# EAGLE design DashHub (EAGLE 9.6.2)
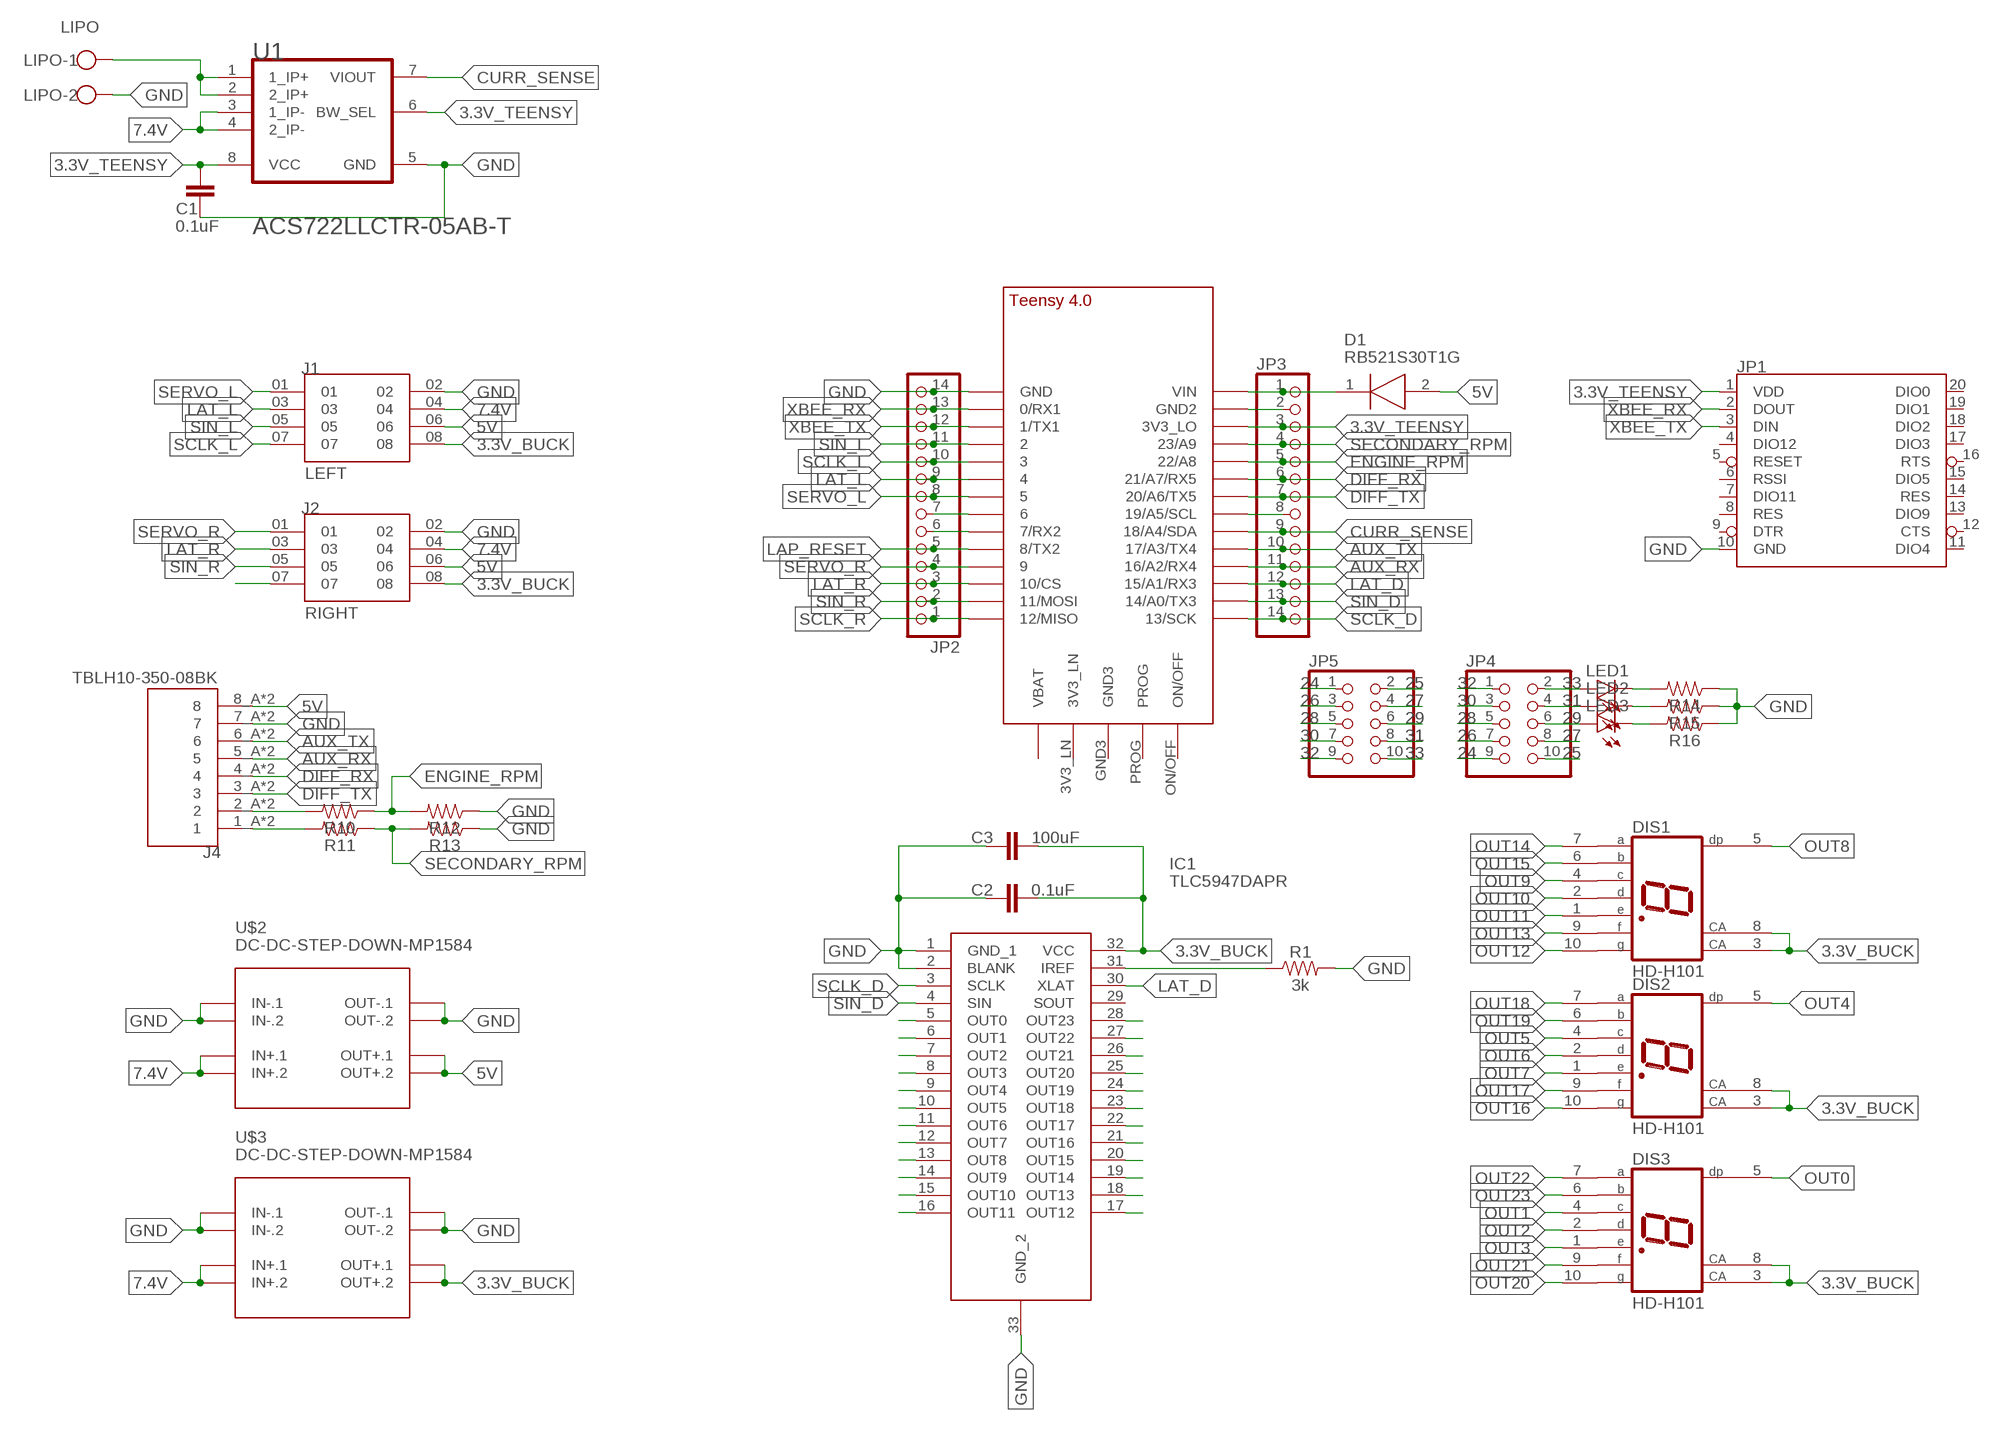
[diagram p0: schematic, sheet 1]

## Parts
C1  0.1uF  C-EUC0402  [C0402]
C2  0.1uF  C-EUC0402  [C0402]
C3  100uF  C-EUC1206  [C1206]
D1  RB521S30T1G  [SODFL1608X70N]
DIS1  HD-H101  [HDSP-M]
DIS2  HD-H101  [HDSP-M]
DIS3  HD-H101  [HDSP-M]
IC1  TLC5947DAPR  [SOP65P810X120-33N]
J1  LEFT  ESW-104-23-L-D  [SAMTEC_ESW-104-23-L-D]
J2  RIGHT  ESW-104-23-L-D  [SAMTEC_ESW-104-23-L-D]
J4  TBLH10-350-08BK  [CUI_TBLH10-350-08BK]
JP1  XBEE  [XBEE]
JP2  PINHD-1X14  [1X14]
JP3  PINHD-1X14  [1X14]
JP4  PINHD-2X5  [2X05]
JP5  PINHD-2X5  [2X05]
LED1  LEDCHIPLED_1206  [CHIPLED_1206]
LED2  LEDCHIPLED_1206  [CHIPLED_1206]
LED3  LEDCHIPLED_1206  [CHIPLED_1206]
LIPO  LIPO  W237-102  [W237-102]
R1  3k  RESISTORAXIAL-0.3  [AXIAL-0.3]
R10  RESISTORAXIAL-0.3  [AXIAL-0.3]
R11  RESISTORAXIAL-0.3  [AXIAL-0.3]
R12  RESISTORAXIAL-0.3  [AXIAL-0.3]
R13  RESISTORAXIAL-0.3  [AXIAL-0.3]
R14  RESISTORAXIAL-0.3  [AXIAL-0.3]
R15  RESISTORAXIAL-0.3  [AXIAL-0.3]
R16  RESISTORAXIAL-0.3  [AXIAL-0.3]
U1  ALLEGRO_MICROSYSTEMS_ACS722LLCTR-05AB-TALLEGRO_MICROSYSTEMS_ACS722LLCTR-05AB-T_0_0  [ALLEGRO_MICROSYSTEMS_ACS722LLCTR-05AB-T_0]
U$1  TEENSY_4.0-BASIC  [TEENSY_4.0-BASIC]
U$2  DC-DC-STEP-DOWN-MP1584  [DC-DC-STEP-DOWN-MP1584]
U$3  DC-DC-STEP-DOWN-MP1584  [DC-DC-STEP-DOWN-MP1584]

## Nets
3.3V_BUCK: C2.2 C3.2 DIS1.3(CA) DIS1.8(CA) DIS2.3(CA) DIS2.8(CA) DIS3.3(CA) DIS3.8(CA) IC1.32(VCC) J1.08 J2.08 U$3.OUT+.1 U$3.OUT+.2
3.3V_TEENSY: C1.2 JP1.1(VDD) JP3.3 U1.6(BW_SEL) U1.8(VCC) U$1.3V3_LO
5V: D1.2(A) J1.06 J2.06 J4.8_A J4.8_B U$2.OUT+.1 U$2.OUT+.2
7.4V: J1.04 J2.04 U1.3(1_IP-) U1.4(2_IP-) U$2.IN+.1 U$2.IN+.2 U$3.IN+.1 U$3.IN+.2
24: JP4.9 JP5.1
25: JP4.10 JP5.2
26: JP4.7 JP5.3
27: JP4.8 JP5.4
28: JP4.5 JP5.5
29: JP4.6 JP5.6 LED3.A
30: JP4.3 JP5.7
31: JP4.4 JP5.8 LED2.A
32: JP4.1 JP5.9
33: JP4.2 JP5.10 LED1.A
AUX_RX: J4.5_A J4.5_B JP3.11 U$1.16/A2(16/A2/RX4)
AUX_TX: J4.6_A J4.6_B JP3.10 U$1.17/A3(17/A3/TX4)
CURR_SENSE: JP3.9 U1.7(VIOUT) U$1.18/A4/SDA
DIFF_RX: J4.4_A J4.4_B JP3.6 U$1.21/A7(21/A7/RX5)
DIFF_TX: J4.3_A J4.3_B JP3.7 U$1.20/A6(20/A6/TX5)
ENGINE_RPM: JP3.5 R10.P$1 R12.P$2 U$1.22/A8
GND: C1.1 C2.1 C3.1 IC1.1(GND_1) IC1.2(BLANK) IC1.33(GND_2) J1.02 J2.02 J4.7_A J4.7_B JP1.10(GND) JP2.14 LIPO.2 R1.P$2 R12.P$1 R13.P$1 R14.P$1 R15.P$1 R16.P$1 U1.5(GND) U$1.GND U$2.IN-.1 U$2.IN-.2 U$2.OUT-.1 U$2.OUT-.2 U$3.IN-.1 U$3.IN-.2 U$3.OUT-.1 U$3.OUT-.2
LAP_RESET: JP2.5 U$1.8(8/TX2)
LAT_D: IC1.30(XLAT) JP3.12 U$1.15/A1(15/A1/RX3)
LAT_L: J1.03 JP2.9 U$1.4/CANRX
LAT_R: J2.03 JP2.3 U$1.10/CS
LIPO_IN: LIPO.1 U1.1(1_IP+) U1.2(2_IP+)
N$1: JP2.7 U$1.6
N$2: D1.1(K) JP3.1 U$1.VIN
N$3: JP2.6 U$1.7(7/RX2)
N$4: JP3.8 U$1.19/A5/SCL
N$11: LED1.C R14.P$2
N$12: LED2.C R15.P$2
N$13: LED3.C R16.P$2
N$17: JP3.2 U$1.GND2
N$23: J4.2_A J4.2_B R10.P$2
N$24: J4.1_A J4.1_B R11.P$2
N$28: IC1.31(IREF) R1.P$1
OUT0: DIS3.5(DP) IC1.5(OUT0)
OUT1: DIS3.4(C) IC1.6(OUT1)
OUT2: DIS3.2(D) IC1.7(OUT2)
OUT3: DIS3.1(E) IC1.8(OUT3)
OUT4: DIS2.5(DP) IC1.9(OUT4)
OUT5: DIS2.4(C) IC1.10(OUT5)
OUT6: DIS2.2(D) IC1.11(OUT6)
OUT7: DIS2.1(E) IC1.12(OUT7)
OUT8: DIS1.5(DP) IC1.13(OUT8)
OUT9: DIS1.4(C) IC1.14(OUT9)
OUT10: DIS1.2(D) IC1.15(OUT10)
OUT11: DIS1.1(E) IC1.16(OUT11)
OUT12: DIS1.10(G) IC1.17(OUT12)
OUT13: DIS1.9(F) IC1.18(OUT13)
OUT14: DIS1.7(A) IC1.19(OUT14)
OUT15: DIS1.6(B) IC1.20(OUT15)
OUT16: DIS2.10(G) IC1.21(OUT16)
OUT17: DIS2.9(F) IC1.22(OUT17)
OUT18: DIS2.7(A) IC1.23(OUT18)
OUT19: DIS2.6(B) IC1.24(OUT19)
OUT20: DIS3.10(G) IC1.25(OUT20)
OUT21: DIS3.9(F) IC1.26(OUT21)
OUT22: DIS3.7(A) IC1.27(OUT22)
OUT23: DIS3.6(B) IC1.28(OUT23)
SCLK_D: IC1.3(SCLK) JP3.14 U$1.13/SCK
SCLK_L: J1.07 JP2.10 U$1.3/CANTX
SCLK_R: J2.07 JP2.1 U$1.12/MISO
SECONDARY_RPM: JP3.4 R11.P$1 R13.P$2 U$1.23/A9
SERVO_L: J1.01 JP2.8 U$1.5
SERVO_R: J2.01 JP2.4 U$1.9/CS
SIN_D: IC1.4(SIN) JP3.13 U$1.14/A0(14/A0/TX3)
SIN_L: J1.05 JP2.11 U$1.2
SIN_R: J2.05 JP2.2 U$1.11/MOSI
XBEE_RX: JP1.2(DOUT) JP2.13 U$1.0/RX(0/RX1)
XBEE_TX: JP1.3(DIN) JP2.12 U$1.1/TX(1/TX1)
Unconnected: IC1.29(SOUT) JP1.4(DIO12) JP1.5(RESET) JP1.6(RSSI) JP1.7(DIO11) JP1.8(RES) JP1.9(DTR) JP1.11(DIO4) JP1.12(CTS) JP1.13(DIO9) JP1.14(RES) JP1.15(DIO5) JP1.16(RTS) JP1.17(DIO3) JP1.18(DIO2) JP1.19(DIO1) JP1.20(DIO0) U$1.3V3_LN U$1.GND3 U$1.ON/OFF U$1.PROG U$1.VBAT\(VBAT)

## Library data of the parts
C1-C3 = rcl:C-EU: CAPACITOR, European symbol; SPICEPREFIX: C
D1 = RB521S30T1G:RB521S30T1G: Schottky Barrier Diode Source: Datasheet <http://www.onsemi.com/pub/Collateral/RB521S30T1-D.PDF>; ARROW_PART_NUMBER: RB521S30T1G; ARROW_PRICE-STOCK: https://www.arrow.com/en/products/rb521s30t1g/on-semiconductor; DESCRIPTION: Schottky Barrier Diode; HEIGHT: 0.7mm; MANUFACTURER_NAME: ON Semiconductor; MANUFACTURER_PART_NUMBER: RB521S30T1G; MOUSER_PART_NUMBER: 863-RB521S30T1G; MOUSER_PRICE-STOCK: https://www.mouser.co.uk/ProductDetail/ON-Semiconductor/RB521S30T1G?qs=xZq1yRCsb1eKFKS8TVH%2Fqg%3D%3D
DIS1-DIS3 = display-hp:HD-H101: LED DISPLAY 1-character 7 segment, decimal point right; OC_FARNELL: unknown; OC_NEWARK: unknown
IC1 = TLC5947DAPR:TLC5947DAPR: 24-Channel, 12-Bit PWM LED Driver with Internal Oscillator Source: Datasheet <https://www.arrow.com/en/products/tlc5947dapr/texas-instruments>; ARROW_PART_NUMBER: TLC5947DAPR; ARROW_PRICE-STOCK: https://www.arrow.com/en/products/tlc5947dapr/texas-instruments; DESCRIPTION: 24-Channel, 12-Bit PWM LED Driver with Internal Oscillator; HEIGHT: 1.2mm; MANUFACTURER_NAME: Texas Instruments; MANUFACTURER_PART_NUMBER: TLC5947DAPR; MOUSER_PART_NUMBER: 595-TLC5947DAPR; MOUSER_PRICE-STOCK: https://www.mouser.co.uk/ProductDetail/Texas-Instruments/TLC5947DAPR?qs=Vj8prLbzEFAFq%2FnrzWbKjQ%3D%3D
J1 J2 = ESW-104-23-L-D:ESW-104-23-L-D; MANUFACTURER: Samtec Inc.; PARTREV: R; STANDARD: Manufacturer Recommendations
J4 = TBLH10-350-08BK:TBLH10-350-08BK; MANUFACTURER: CUI; STANDARD: Manufacturer Recommendations
JP1 = SparkFun-RF:XBEE: Digi XBee and XBee Pro XBees are tiny blue chips that can communicate wirelessly with each other. They can do simple things, like replacing a couple of wires in serial communication, which is nice when you want to make a remote for your paintball vehicle. SparkFun Products SparkFun XBee Buying Guide <https://www.sparkfun.com/pages/xbee_guide> SparkFun XBee Explorer USB <https://www.sparkfun.com/products/11812> (WRL-11812) Breakout Board for XBee Module <https://www.sparkfun.com/products/8276> (WRL-8276) SparkFun XBee Explorer Regulated <https://www.sparkfun.com/products/11373> (WRL-11373) SparkFun XBee Explorer Dongle <https://www.sparkfun.com/products/11697> (WRL-11697) SparkFun XBee Shield <https://www.sparkfun.com/products/12847> (WRL-12847) SparkFun XBee Explorer Serial <https://www.sparkfun.com/products/13225> (WRL-13225)
JP2 JP3 = pinhead:PINHD-1X14: PIN HEADER
JP4 JP5 = pinhead:PINHD-2X5: PIN HEADER
LED1-LED3 = led:LED: LED OSRAM: - CHIPLED LG R971, LG N971, LY N971, LG Q971, LY Q971, LO R971, LY R971 LH N974, LH R974 LS Q976, LO Q976, LY Q976 LO Q996 - Hyper CHIPLED LW Q18S LB Q993, LB Q99A, LB R99A - SideLED LS A670, LO A670, LY A670, LG A670, LP A670 LB A673, LV A673, LT A673, LW A673 LH A674 LY A675 LS A676, LA A676, LO A676, LY A676, LW A676 LS A679, LY A679, LG A679 - Hyper Micro SIDELED® LS Y876, LA Y876, LO Y876, LY Y876 LT Y87S - SmartLED LW L88C, LW L88S LB L89C, LB L89S, LG L890 LS L89K, LO L89K, LY L89K LS L896, LA L896, LO L896, LY L896 - TOPLED LS T670, LO T670, LY T670, LG T670, LP T670 LSG T670, LSP T670, LSY T670, LOP T670, LYG T670 LG T671, LOG T671, LSG T671 LB T673, LV T673, LT T673, LW T673 LH T674 LS T676, LA T676, LO T676, LY T676, LB T676, LH T676, LSB T676, LW T676 LB T67C, LV T67C, LT T67C, LS T67K, LO T67K, LY T67K, LW E67C LS E67B, LA E67B, LO E67B, LY E67B, LB E67C, LV E67C, LT E67C LW T67C LS T679, LY T679, LG T679 LS T770, LO T770, LY T770, LG T770, LP T770 LB T773, LV T773, LT T773, LW T773 LH T774 LS E675, LA E675, LY E675, LS T675 LS T776, LA T776, LO T776, LY T776, LB T776 LHGB T686 LT T68C, LB T68C - Hyper Mini TOPLED® LB M676 - Mini TOPLED Santana® LG M470 LS M47K, LO M47K, LY M47K Source: http://www.osram.convergy.de LUXEON: - LUMILED® LXK2-PW12-R00, LXK2-PW12-S00, LXK2-PW14-U00, LXK2-PW14-V00 LXK2-PM12-R00, LXK2-PM12-S00, LXK2-PM14-U00 LXK2-PE12-Q00, LXK2-PE12-R00, LXK2-PE12-S00, LXK2-PE14-T00, LXK2-PE14-U00 LXK2-PB12-K00, LXK2-PB12-L00, LXK2-PB12-M00, LXK2-PB14-N00, LXK2-PB14-P00, LXK2-PB14-Q00 LXK2-PR12-L00, LXK2-PR12-M00, LXK2-PR14-Q00, LXK2-PR14-R00 LXK2-PD12-Q00, LXK2-PD12-R00, LXK2-PD12-S00 LXK2-PH12-R00, LXK2-PH12-S00 LXK2-PL12-P00, LXK2-PL12-Q00, LXK2-PL12-R00 Source: www.luxeon.com KINGBRIGHT: KA-3528ASYC Source: www.kingbright.com
LIPO = con-wago-500:W237-102: WAGO SCREW CLAMP; MPN: 237-102; OC_FARNELL: unknown; OC_NEWARK: 70K9898
R1 R10-R16 = SparkFun-Resistors:RESISTOR: Generic Resistor Package
U1 = Allegro MicroSystems - ACS722LLCTR-05AB-T:ALLEGRO_MICROSYSTEMS_ACS722LLCTR-05AB-T: ALEG-ACS722-SOIC-8; CIIVA_IDS: 20395501; COMPONENT_LINK_1_DESCRIPTION: Manufacturer URL; COMPONENT_LINK_1_URL: http://www.allegromicro.com/; COMPONENT_LINK_3_DESCRIPTION: Package Specification; COMPONENT_LINK_3_URL: http://www.allegromicro.com/~/media/Files/Datasheets/ACS711-Datasheet.ashx?la=en; DATASHEET: http://www.allegromicro.com/~/media/Files/Datasheets/ACS722-Datasheet.ashx?la=en; FOOTPRINT_VARIANT_NAME_0: Manufacturer Recommended; IMPORTED: yes; IMPORTED_FROM: vault; IMPORT_TS: 1521843836; IP_MAX: 5 A; IP_MIN: -5 A; MF: Allegro MicroSystems; MOUNTING_TECHNOLOGY: Surface Mount; MPN: ACS722LLCTR-05AB-T; PACKAGE_DESCRIPTION: 8-Pin Small Outline Integrated Package, Body 4.9 x 3.9 mm, Pitch 1.27 mm; PACKING: Tape and Reel; PREFIX: U; RELEASE_DATE: 1439174706; ROHS: Yes; TEMPERATURE_MAX: 150 degC; TEMPERATURE_MIN: -40 degC; VAULT_GUID: 23CF8DBA-208E-4E0F-A1B8-C7EE78FE94DB; VAULT_REVISION: 60592E21-24CC-4A18-AB0C-D50A27DFFA24; VCC_MAX: 3.6 V; VCC_MIN: 3 V
U$1 = Teensy-4.0:TEENSY_4.0-BASIC
U$2 U$3 = diy-modules:DC-DC-STEP-DOWN-MP1584: DC/DC Step-Down Regulator based on MP1584 chip MP1584 datasheet available here: http://www.haoyuelectronics.com/Attachment/MP1584/MP1584.pdf Click here to find device on ebay.com <http://www.ebay.com/sch/mp1584+module>

## Board
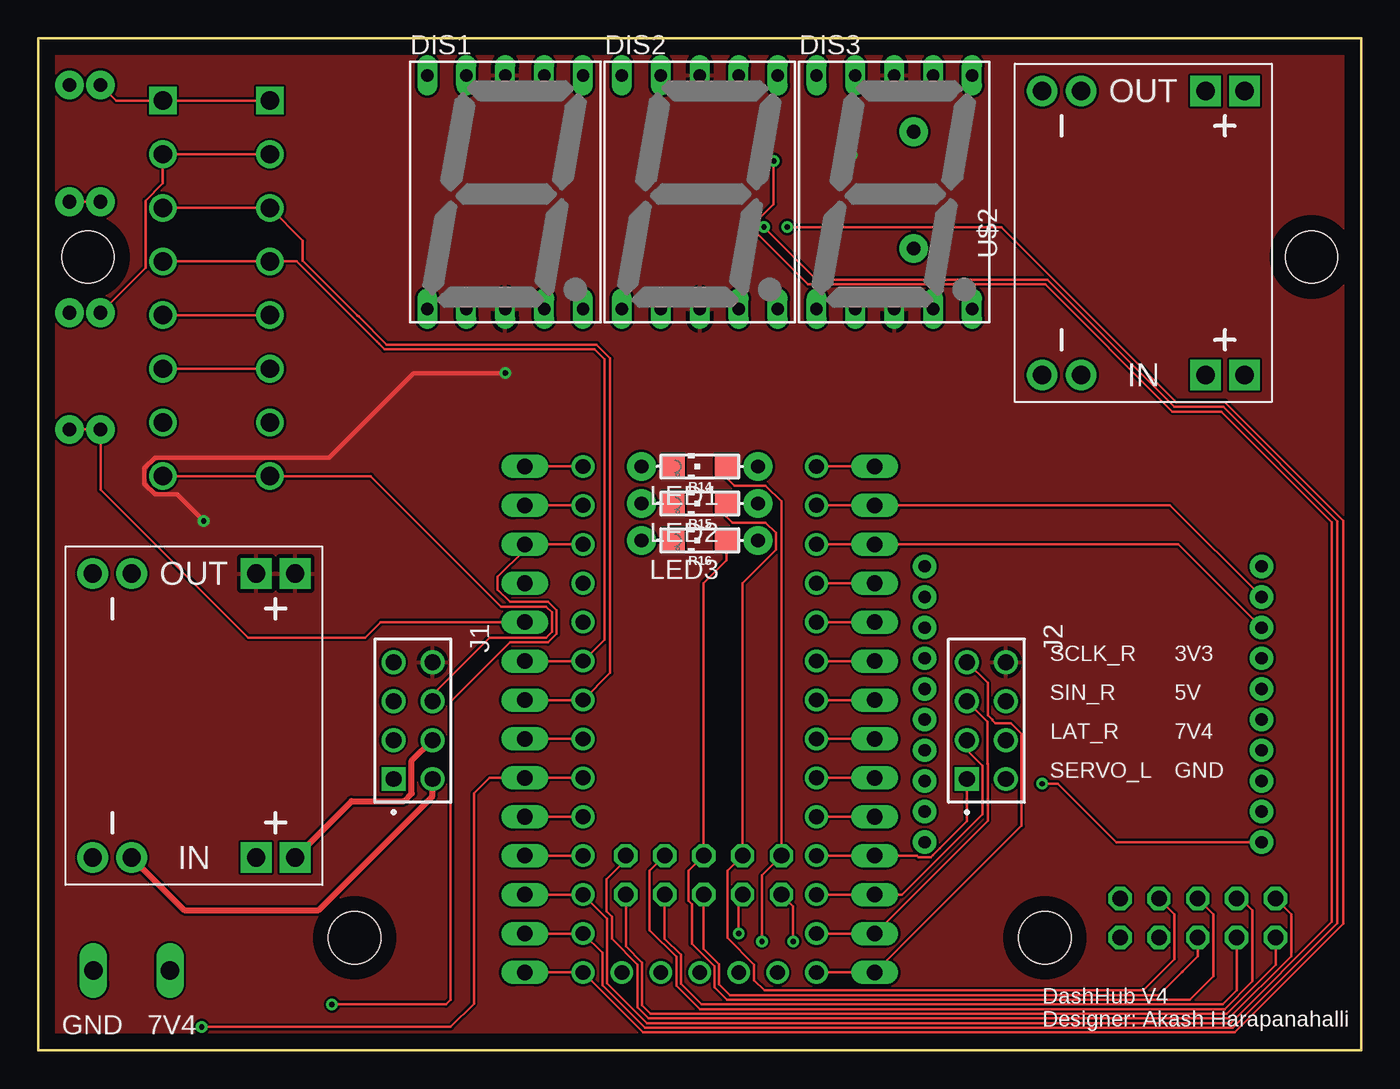
[diagram p1: board, top side]
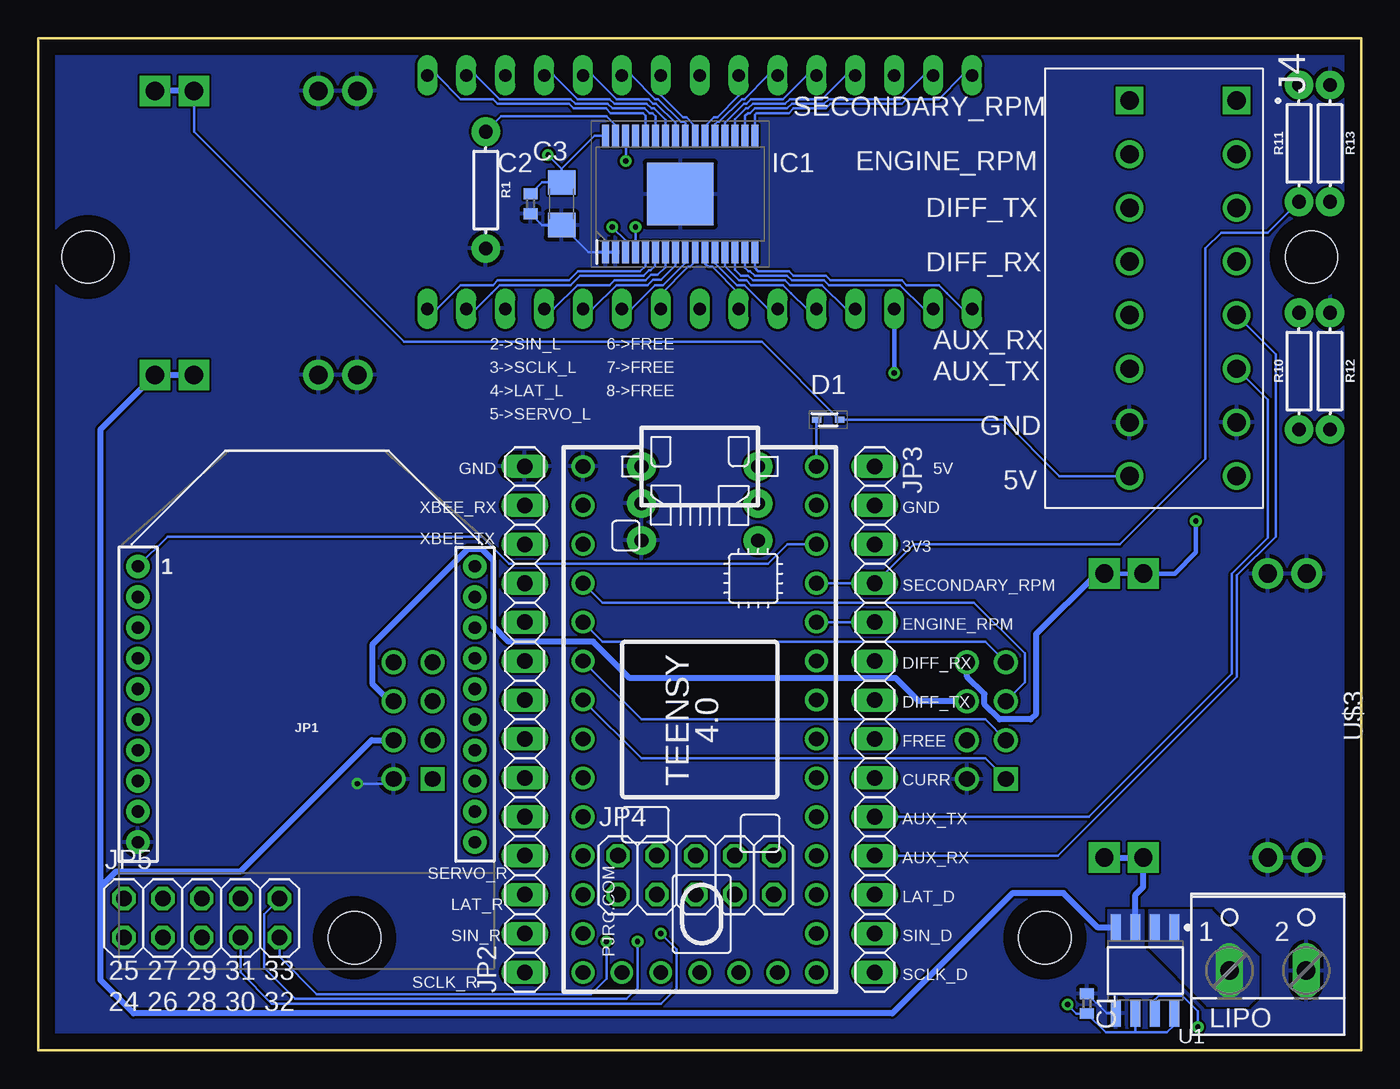
[diagram p2: board, bottom side, seen from below]

Size 86.36 x 66.04 mm. Coordinates in mm from the lower left corner, seen from the top.
Outline: 0,66.04 0,0 86.36,0 86.36,66.04 0,66.04
Copper layers (1*16): Top 0.035mm / dielectric 1.5mm / Bottom 0.035mm
Design rules "default": minimum track width 6mil, minimum drill 0.35mm, track to track 6mil, track to pad 6mil, pad to pad 6mil, via to via 6mil, smd to smd 6mil, copper to edge 40mil, drill to drill 6mil, minimum pad ring 10mil, minimum via ring 8mil, stop-mask expansion 4mil, vias tented up to drill 0mil, thermal gap 10mil
Holes 3.4 mm at 65.71,7.34 83.11,51.77 20.65,7.34 3.25,51.77

### Footprints (pad centres in the part's own frame; a part is rotated, then mirrored left to right if it is on the bottom)
C0402 = smd 0.7 x 0.9: 1 -0.65,0; 2 0.65,0
C1206 = smd 1.6 x 1.8: 1 -1.4,0; 2 1.4,0
SODFL1608X70N = smd 0.64 x 0.42: 1 -0.75,0; 2 0.75,0
HDSP-M = drill 0.813 long: 1 -5.08,-7.62; 2 -2.54,-7.62; 3 0,-7.62; 4 2.54,-7.62; 5 5.08,-7.62; 6 5.08,7.62; 7 2.54,7.62; 8 0,7.62; 9 -2.54,7.62; 10 -5.08,7.62
SOP65P810X120-33N = smd 1.475 x 0.45: 1 -3.788,4.875; 2 -3.788,4.225; 3 -3.788,3.575; 4 -3.788,2.925; 5 -3.788,2.275; 6 -3.788,1.625; 7 -3.788,0.975; 8 -3.788,0.325; 9 -3.788,-0.325; 10 -3.788,-0.975; 11 -3.788,-1.625; 12 -3.788,-2.275; 13 -3.788,-2.925; 14 -3.788,-3.575; 15 -3.788,-4.225; 16 -3.788,-4.875; 17 3.788,-4.875; 18 3.788,-4.225; 19 3.788,-3.575; 20 3.788,-2.925; 21 3.788,-2.275; 22 3.788,-1.625; 23 3.788,-0.975; 24 3.788,-0.325; 25 3.788,0.325; 26 3.788,0.975; 27 3.788,1.625; 28 3.788,2.275; 29 3.788,2.925; 30 3.788,3.575; 31 3.788,4.225; 32 3.788,4.875 | smd 4.11 x 4.36: 33 0,0
SAMTEC_ESW-104-23-L-D = drill 1.04 pad 1.39 square: 01 0,0 | drill 1.04 pad 1.39: 02 0,2.54; 03 -2.54,0; 04 -2.54,2.54; 05 -5.08,0; 06 -5.08,2.54; 07 -7.62,0; 08 -7.62,2.54
CUI_TBLH10-350-08BK = drill 1.2 square: 1_A 0,0; 1_B 0,-7 | drill 1.2: 2_A 3.5,0; 2_B 3.5,-7; 3_A 7,0; 3_B 7,-7; 4_A 10.5,0; 4_B 10.5,-7; 5_A 14,0; 5_B 14,-7; 6_A 17.5,0; 6_B 17.5,-7; 7_A 21,0; 7_B 21,-7; 8_A 24.5,0; 8_B 24.5,-7
XBEE = drill 0.8 pad 1.524: 1 -11,20; 2 -11,18; 3 -11,16; 4 -11,14; 5 -11,12; 6 -11,10; 7 -11,8; 8 -11,6; 9 -11,4; 10 -11,2; 11 11,2; 12 11,4; 13 11,6; 14 11,8; 15 11,10; 16 11,12; 17 11,14; 18 11,16; 19 11,18; 20 11,20
1X14 = drill 1.016 long: 1 -16.51,0; 2 -13.97,0; 3 -11.43,0; 4 -8.89,0; 5 -6.35,0; 6 -3.81,0; 7 -1.27,0; 8 1.27,0; 9 3.81,0; 10 6.35,0; 11 8.89,0; 12 11.43,0; 13 13.97,0; 14 16.51,0
2X05 = drill 1.016 octagon: 1 -5.08,-1.27; 2 -5.08,1.27; 3 -2.54,-1.27; 4 -2.54,1.27; 5 0,-1.27; 6 0,1.27; 7 2.54,-1.27; 8 2.54,1.27; 9 5.08,-1.27; 10 5.08,1.27
CHIPLED_1206 = smd 1.5 x 1.5: A 0,-1.75; C 0,1.75
W237-102 = drill 1.194 long: 1 -2.5,-1.27; 2 2.5,-1.27
AXIAL-0.3 = drill 0.9 pad 1.88: P$1 -3.81,0; P$2 3.81,0
ALLEGRO_MICROSYSTEMS_ACS722LLCTR-05AB-T_0 = smd 0.65 x 1.75: 1 -1.905,-2.8; 2 -0.635,-2.8; 3 0.635,-2.8; 4 1.905,-2.8; 5 1.905,2.8; 6 0.635,2.8; 7 -0.635,2.8; 8 -1.905,2.8
TEENSY_4.0-BASIC = drill 0.965: 0/RX -13.97,-7.62; 1/TX -11.43,-7.62; 2 -8.89,-7.62; 3/CANTX -6.35,-7.62; 3V3_LN 16.51,-2.54; 3V3_LO -11.43,7.62; 4/CANRX -3.81,-7.62; 5 -1.27,-7.62; 6 1.27,-7.62; 7 3.81,-7.62; 8 6.35,-7.62; 9/CS 8.89,-7.62; 10/CS 11.43,-7.62; 11/MOSI 13.97,-7.62; 12/MISO 16.51,-7.62; 13/SCK 16.51,7.62; 14/A0 13.97,7.62; 15/A1 11.43,7.62; 16/A2 8.89,7.62; 17/A3 6.35,7.62; 18/A4/SDA 3.81,7.62; 19/A5/SCL 1.27,7.62; 20/A6 -1.27,7.62; 21/A7 -3.81,7.62; 22/A8 -6.35,7.62; 23/A9 -8.89,7.62; GND -16.51,-7.62; GND2 -13.97,7.62; GND3 16.51,0; ON/OFF 16.51,5.08; PROG 16.51,2.54; VBAT\ 16.51,-5.08; VIN -16.51,7.62
DC-DC-STEP-DOWN-MP1584 = drill 1.2 pad 2 square: IN+.1 -9.271,-4.064; IN+.2 -9.271,-6.604; OUT+.1 9.271,-4.064; OUT+.2 9.271,-6.604 | drill 1.2 pad 2: IN-.1 -9.271,6.604; IN-.2 -9.271,4.064; OUT-.1 9.271,6.604; OUT-.2 9.271,4.064

### Placement (x,y rotation side)
C1  17.91,3.05 270 bottom
C2  54.23,55.25 90 bottom
C3  52.2,55.25 90 bottom
D1  34.8,41.15 0 bottom
DIS1  30.48,56.01 0 top
DIS2  43.18,56.01 0 top
DIS3  55.88,56.01 0 top
IC1  44.45,55.88 90 bottom
J1  23.19,17.7 270 top
J2  60.63,17.7 270 top
J4  8.13,61.98 270 bottom
JP1  68.86,11.58 0 bottom
JP2  54.61,21.59 90 bottom
JP3  31.75,21.59 270 bottom
JP4  43.43,11.43 0 bottom
JP5  75.69,8.64 0 bottom
LED1  43.18,38.1 90 top
LED2  43.18,35.69 90 top
LED3  43.18,33.27 90 top
LIPO  6.1,6.48 0 bottom
R1  57.15,56.13 270 bottom
R10  4.06,44.32 90 bottom
R11  4.06,59.18 90 bottom
R12  2.03,44.32 270 bottom
R13  2.03,59.18 270 bottom
R14  43.18,38.1 180 top
R15  43.18,35.69 180 top
R16  43.18,33.27 180 top
U1  14.1,5.21 180 bottom
U$1  43.18,21.59 270 bottom
U$2  72.14,53.34 90 top
U$3  10.16,21.84 90 top

### Tracks (layer width: path | path; a pad name or v marks a point on that pad's centre or on a via)
3.3V_BUCK  (via drill 0.35)
  Top 0.305: v30.48,44.2 24.51,44.2 19,38.68 7.63,38.68 6.92,37.98 6.92,36.98 7.63,36.27 9.07,36.27 v10.8,34.54
  Bottom 0.152: IC1.32 50.06,59.67 52.2,57.53 | 52.2,57.53 C3.2 53.48,56.65 C2.2 | v53.09,58.42 52.2,57.53
  Bottom 0.305: v10.8,34.54 10.8,32.49 12.17,31.12 U$3.OUT+.1 U$3.OUT+.2 | v30.48,44.2 DIS1.3
  Bottom 0.406: J1.08 25.73,24.39 24.59,23.25 24.59,22.58 23.6,21.59 21.59,21.59 21.21,21.97 21.21,27.18 17.27,31.12 U$3.OUT+.2
  pour Top: 101.35,73.03 101.35,-0.63 -9.09,-0.63 -18.23,8.51 -18.23,73.84 -15.88,76.2 98.17,76.2
3.3V_TEENSY  (via drill 0.35)
  Top 0.152: U$1.3V3_LO JP3.3 31.75,32.64 30,30.89 30,30.07 30.81,29.26 33.27,29.26 33.83,28.7 33.83,27.18 33.27,26.62 30.81,26.62 26.92,22.74 26.92,3.3 26.62,2.99 v19.18,2.99
  Bottom 0.152: U$1.3V3_LO 37.47,33.02 38.73,31.75 55.63,31.75 57.4,33.53 77.91,33.53 JP1.1 | U1.8 12.19,1.65 12.68,1.17 14.73,1.17 | 14.73,1.17 16.68,1.17 C1.2 18.58,2.4 v19.18,2.99 | U1.6 14.73,1.17
5V
  Top 0.152: J4.8_A J4.8_B 21.71,37.48 30.23,28.96 33.15,28.96 33.53,28.58 33.53,27.31 33.15,26.92 29.46,26.92 25.73,23.19 J1.06
  Bottom 0.152: J4.8_B 19.7,37.48 23.37,41.15 D1.2 39.13,46.23 62.48,46.23 76.2,59.94 U$2.OUT+.1
  Bottom 0.406: J1.06 28.88,22.78 30.38,24.28 47.75,24.28 50.14,26.67 55.68,26.67 56.64,27.63 56.64,31.95 57.4,32.7 58.32,32.7 64.56,26.46 64.56,23.93 63.42,22.78 J2.06 | U$2.OUT+.1 U$2.OUT+.2
7.4V
  Top 0.406: U$3.IN+.2 20.45,16.26 23.88,16.26 24.38,16.76 24.38,18.9 J1.04
  Bottom 0.406: U1.4 17.19,8.01 19.44,10.26 22.76,10.26 30.61,2.41 80.14,2.41 82.3,4.57 82.3,10.67 | J2.04 64.59,20.24 73.15,11.68 81.28,11.68 82.3,10.67 | U$3.IN+.2 U$3.IN+.1 14.22,10.67 14.73,10.16 U1.3 | 82.3,10.67 82.3,40.51 U$2.IN+.2 U$2.IN+.1
  pour Bottom (no thermals): 14.22,9.14 14.22,6.86 16.51,6.86 16.51,9.14
24
  Top 0.152: JP5.1 80.77,5.59 77.57,2.39 39.98,2.39 39.42,2.94 39.42,5.71 38.35,6.78 JP4.9
25
  Top 0.152: JP4.10 38.35,12.45 37.08,11.18 37.08,9.07 37.44,8.71 37.44,7.26 39.12,5.59 39.12,2.82 39.85,2.08 77.72,2.08 81.79,6.15 81.79,8.89 JP5.2
26
  Top 0.152: JP4.7 40.89,7.29 41.96,6.22 41.96,4.34 43.31,3 77.32,3 78.23,3.91 JP5.3
27
  Top 0.152: JP4.8 39.9,11.71 39.9,7.85 41.66,6.1 41.66,4.22 43.18,2.69 77.44,2.69 79.25,4.5 79.25,9.14 78.49,9.91 JP5.4
28
  Top 0.152: JP4.5 43.43,6.62 44.45,5.61 44.45,4.32 45.16,3.61 73.15,3.61 74.65,5.11 74.7,5.16 75.69,6.15 JP5.5
29
  Top 0.152: LED3.A 44.93,31.98 43.43,30.48 JP4.6 42.44,11.71 42.44,9.75 42.67,9.52 42.67,6.95 44.15,5.48 44.15,4.12 44.96,3.3 75.18,3.3 76.71,4.83 76.71,8.89 JP5.6
30  (via drill 0.35)
  Top 0.152: v45.72,7.62 45.72,9.91 JP4.3
  Bottom 0.152: v45.72,7.62 44.7,6.6 44.7,4.06 45.72,3.05 71.12,3.05 73.15,5.08 JP5.7
31
  Top 0.152: LED2.A 44.93,34.83 45.31,34.44 47.47,34.44 48.16,33.76 48.16,32.66 45.97,30.48 JP4.4 44.98,11.71 44.98,7.34 46.74,5.59 46.74,4.57 47.4,3.91 72.14,3.91 74.17,5.94 74.17,8.89 JP5.8
32  (via drill 0.35)
  Top 0.152: v49.28,7.11 49.28,9.4 JP4.1
  Bottom 0.152: v49.28,7.11 49.28,4.67 50.29,3.66 68.17,3.66 70.61,6.1 JP5.9
33  (via drill 0.35)
  Top 0.152: LED1.A 44.93,37.37 45.44,36.86 47.47,36.86 48.51,35.82 JP4.2 47.24,11.43 v47.24,7.11
  Bottom 0.152: v47.24,7.11 47.24,4.06 47.95,3.35 69.6,3.35 71.63,5.39 71.63,8.89 JP5.10
AUX_RX
  Top 0.152: JP3.11 U$1.16/A2 | J4.5_A J4.5_B
  Bottom 0.152: JP3.11 19.81,12.7 8.13,24.38 8.13,30.99 5.59,33.53 5.59,45.44 J4.5_A
AUX_TX
  Top 0.152: JP3.10 U$1.17/A3 | J4.6_A J4.6_B
  Bottom 0.152: JP3.10 17.78,15.24 8.43,24.59 8.43,31.11 6.1,33.45 6.1,42.44 J4.6_A
CURR_SENSE  (via drill 0.35)
  Top 0.152: U$1.18/A4/SDA JP3.9 29.46,17.78 28.45,16.76 28.45,3.05 26.92,1.52 v10.67,1.52
  Bottom 0.152: U1.7 13.46,3.3 13.21,3.56 11.68,3.56 10.67,2.54 v10.67,1.52
DIFF_RX
  Top 0.152: J4.4_A J4.4_B 16.88,51.48 22.12,46.23 22.24,46.11 22.61,45.75 36.3,45.75 36.96,45.09 36.96,26.8 U$1.21/A7 JP3.6
DIFF_TX
  Top 0.152: J4.3_A J4.3_B 17.27,52.83 17.27,51.51 20.81,47.98 20.93,47.85 22.73,46.05 36.45,46.05 37.34,45.16 37.34,24.64 U$1.20/A6 JP3.7
ENGINE_RPM
  Top 0.152: R12.P$2 R10.P$1 4.06,36.58 13.72,26.92 21.34,26.92 22.35,27.94 JP3.5
  Bottom 0.152: U$1.22/A8 JP3.5
GND  (via drill 0.35)
  Top 0.152: JP2.14 U$1.GND | JP1.10 70.36,13.58 66.55,17.4 v65.53,17.4
  Top 0.406: U$3.IN-.2 9.52,9.14 18.29,9.14 25.73,16.59 J1.02
  Bottom 0.152: C2.1 53.48,53.84 C3.1 50.44,52.09 IC1.1 IC1.2 | C1.1 16.62,2.41 U1.5 | v65.53,17.4 63.48,17.4 J2.02
  pour Bottom (rank 5): -13.45,71.77 -13.45,5.33 -7.1,-1.02 99.06,-1.02 99.06,72.14 98.42,72.77 -12.45,72.77
LAP_RESET
  Top 0.152: JP2.5 U$1.8
LAT_D  (via drill 0.35)
  Top 0.152: JP3.12 U$1.15/A1 37.13,8.59 37.13,4.37 39.72,1.78 77.85,1.78 84.45,8.38 84.45,34.44 77.22,41.68 74.04,41.68 65.74,49.99 50.25,49.99 46.76,53.47 46.76,53.97 48.01,55.21 v48.01,58.04
  Bottom 0.152: v48.01,58.04 48.01,59.65 IC1.30
LAT_L
  Top 0.152: JP2.9 U$1.4/CANRX
  Bottom 0.152: J1.03 24.54,21.59 46.99,21.59 U$1.4/CANRX
LAT_R
  Top 0.152: U$1.10/CS JP2.3 56.39,10.16 61.64,15.41 61.64,18.58 60.63,19.59 J2.03
LIPO_IN
  pour Bottom (no thermals): 13.84,9.14 13.84,6.73 10.03,2.92 7.37,2.92 6.73,3.56 6.73,6.1 9.78,9.14
N$1
  Top 0.152: U$1.6 JP2.7
N$2
  Top 0.152: JP3.1 U$1.VIN
  Bottom 0.152: U$1.VIN 35.56,41.14 D1.1
N$3
  Top 0.152: U$1.7 JP2.6
N$4
  Top 0.152: U$1.19/A5/SCL JP3.8
N$11
  Top 0.152: R14.P$2 LED1.C
N$12
  Top 0.152: LED2.C R15.P$2
N$13
  Top 0.152: R16.P$2 LED3.C
N$17
  Top 0.152: JP3.2 U$1.GND2
N$23
  Top 0.152: J4.2_B J4.2_A 8.13,56.57 7,55.44 7,51.07 R10.P$2
N$24
  Top 0.152: J4.1_B J4.1_A 5.08,61.98 R11.P$2
N$28
  Bottom 0.152: IC1.31 48.67,60.36 49.28,60.96 56.13,60.96 R1.P$1
OUT0
  Bottom 0.152: IC1.5 46.74,52.08 46.74,51.18 47.07,50.85 51.12,50.85 51.73,50.24 56.37,50.24 56.68,49.94 58.79,49.94 60.34,48.39 DIS3.5
OUT1
  Bottom 0.152: IC1.6 46.1,52.07 46.1,51.18 46.38,50.9 46.48,50.9 46.84,50.55 50.99,50.55 51.6,49.94 56.25,49.94 56.77,49.42 56.77,49.4 57.78,48.39 DIS3.4
OUT2
  Bottom 0.152: IC1.7 45.42,51.09 45.92,50.6 46.35,50.6 46.71,50.24 48.75,50.24 49.06,49.94 51.17,49.94 52.72,48.39 DIS3.2
OUT3
  Bottom 0.152: IC1.8 44.77,51.24 45.72,50.29 46.23,50.29 46.58,49.94 48.63,49.94 50.18,48.39 DIS3.1
OUT4
  Bottom 0.152: IC1.9 44.12,51.38 45.57,49.94 46.09,49.94 47.64,48.39 DIS2.5
OUT5
  Bottom 0.152: IC1.10 43.48,51.46 43.8,51.13 43.95,51.13 45.72,49.35 DIS2.4
OUT6
  Bottom 0.152: IC1.11 42.83,51.33 42.62,51.13 42.36,51.13 40.64,49.4 DIS2.2
OUT7
  Bottom 0.152: IC1.12 42.17,51.37 40.74,49.94 40.27,49.94 38.72,48.39 DIS2.1
OUT8
  Bottom 0.152: IC1.13 41.52,51.15 40.62,50.24 40.15,50.24 39.84,49.94 37.73,49.94 37.21,49.42 37.21,49.4 36.2,48.39 DIS1.5
OUT9
  Bottom 0.152: IC1.14 40.88,50.93 40.49,50.55 40.02,50.55 39.71,50.24 37.61,50.24 37.3,49.94 35.19,49.94 33.64,48.39 DIS1.4
OUT10
  Bottom 0.152: IC1.15 40.23,51.07 40.01,50.85 39.89,50.85 39.59,50.55 37.48,50.55 37.17,50.24 35.07,50.24 34.76,49.94 30.11,49.94 28.56,48.39 DIS1.2
OUT11
  Bottom 0.152: IC1.16 39.58,51.06 39.37,50.85 37.35,50.85 37.05,50.55 34.94,50.55 34.63,50.24 29.99,50.24 29.68,49.94 27.57,49.94 27.05,49.42 27.05,49.4 26.04,48.39 DIS1.1
OUT12
  Bottom 0.152: IC1.17 39.58,61.05 39.46,61.16 37.35,61.16 37.05,61.47 34.94,61.47 34.63,61.77 29.99,61.77 29.68,62.08 27.57,62.08 26.02,63.63 DIS1.10
OUT13
  Bottom 0.152: IC1.18 40.23,60.97 40.03,61.16 39.89,61.16 39.59,61.47 37.48,61.47 37.17,61.77 35.07,61.77 34.76,62.08 30.11,62.08 28.56,63.63 DIS1.9
OUT14
  Bottom 0.152: IC1.19 40.88,60.75 40.16,61.47 40.02,61.47 39.71,61.77 37.61,61.77 37.3,62.08 35.19,62.08 33.64,63.63 DIS1.7
OUT15
  Bottom 0.152: IC1.20 41.52,60.53 40.28,61.77 40.15,61.77 39.84,62.08 37.73,62.08 36.18,63.63 DIS1.6
OUT16
  Bottom 0.152: IC1.21 42.17,60.44 42.04,60.58 41.91,60.58 40.41,62.08 40.27,62.08 38.72,63.63 DIS2.10
OUT17
  Bottom 0.152: IC1.22 42.83,60.3 42.24,60.88 42.04,60.88 40.64,62.28 DIS2.9
OUT18
  Bottom 0.152: IC1.23 43.48,60.3 44.05,60.88 44.27,60.88 45.72,62.33 DIS2.7
OUT19
  Bottom 0.152: IC1.24 44.12,60.51 44.2,60.58 44.4,60.58 45.9,62.08 46.09,62.08 47.64,63.63 DIS2.6
OUT20
  Bottom 0.152: IC1.25 44.77,60.52 46.02,61.77 46.21,61.77 46.52,62.08 48.63,62.08 50.18,63.63 DIS3.10
OUT21
  Bottom 0.152: IC1.26 45.42,60.74 46.15,61.47 46.34,61.47 46.65,61.77 48.75,61.77 49.06,62.08 51.17,62.08 52.72,63.63 DIS3.9
OUT22
  Bottom 0.152: IC1.27 46.08,60.96 46.28,61.16 46.47,61.16 46.77,61.47 48.88,61.47 49.19,61.77 51.29,61.77 51.6,62.08 56.25,62.08 57.8,63.63 DIS3.7
OUT23
  Bottom 0.152: IC1.28 46.73,60.99 46.9,61.16 49.01,61.16 49.31,61.47 51.42,61.47 51.73,61.77 56.37,61.77 56.68,62.08 58.79,62.08 60.34,63.63 DIS3.6
SCLK_D  (via drill 0.35)
  Top 0.152: JP3.14 U$1.13/SCK 39.47,1.17 78.1,1.17 85.19,8.26 85.19,34.57 77.47,42.29 74.3,42.29 62.86,53.72 v48.89,53.72
  Bottom 0.152: IC1.3 48.01,52.11 48.01,52.83 v48.89,53.72
SCLK_L
  Top 0.152: JP2.10 U$1.3/CANTX
  Bottom 0.152: J1.07 24.54,26.67 49.53,26.67 U$1.3/CANTX
SCLK_R
  Top 0.152: U$1.12/MISO JP2.1 64.18,14.65 64.18,20.66 63.5,21.34 62.48,21.34 62.27,21.55 62.27,21.57 61.98,21.87 61.98,23.98 J2.07
SECONDARY_RPM
  Top 0.152: R11.P$1 R13.P$2
  Bottom 0.152: R11.P$1 6.1,53.34 9.14,53.34 10.16,52.32 10.16,38.61 15.75,33.02 29.21,33.02 JP3.4 U$1.23/A9
SERVO_L
  Top 0.152: JP2.8 U$1.5
  Bottom 0.152: J1.01 24.54,19.05 46.99,19.05 U$1.5
SERVO_R
  Top 0.152: U$1.9/CS JP2.4 57.34,12.7 57.45,12.59 58.27,12.59 58.4,12.72 58.85,13.17 60.63,14.95 J2.01
SIN_D  (via drill 0.35)
  Top 0.152: JP3.13 U$1.14/A0 36.83,6.35 36.83,4.24 39.6,1.47 77.98,1.47 84.8,8.29 84.8,34.53 77.34,41.99 74.17,41.99 65.86,50.29 50.8,50.29 v47.37,53.72
  Bottom 0.152: v47.37,53.72 IC1.4
SIN_L
  Top 0.152: JP2.11 U$1.2
  Bottom 0.152: J1.05 21.97,24 21.97,25.91 25.27,29.21 49.53,29.21 U$1.2
SIN_R
  Top 0.152: U$1.11/MOSI JP2.2 61.98,14.99 61.98,18.7 61.97,18.71 61.97,21.45 J2.05
XBEE_RX
  Top 0.152: U$1.0/RX JP2.13 73.88,35.56 JP1.2
XBEE_TX
  Top 0.152: U$1.1/TX JP2.12 74.42,33.02 JP1.3

### Text on the board
tPlace: SCLK_R | 3V3 | SIN_R | 5V | LAT_R | 7V4 | SERVO_L | GND | DashHub V4 / Designer: Akash Harapanahalli | GND | 7V4
bPlace: SECONDARY_RPM | ENGINE_RPM | DIFF_TX | DIFF_RX | AUX_RX | 6->FREE | 2->SIN_L | AUX_TX | 7->FREE | 3->SCLK_L | 8->FREE | 4->LAT_L | 5->SERVO_L | GND | 5V | GND | 5V | GND | XBEE_RX | XBEE_TX | 3V3 | SECONDARY_RPM | ENGINE_RPM | DIFF_RX | DIFF_TX | FREE | CURR | AUX_TX | AUX_RX | SERVO_R | LAT_D | LAT_R | SIN_D | SIN_R | SCLK_D | 33 | 31 | 29 | 27 | 25 | SCLK_R | 32 | 30 | 28 | 26 | 24